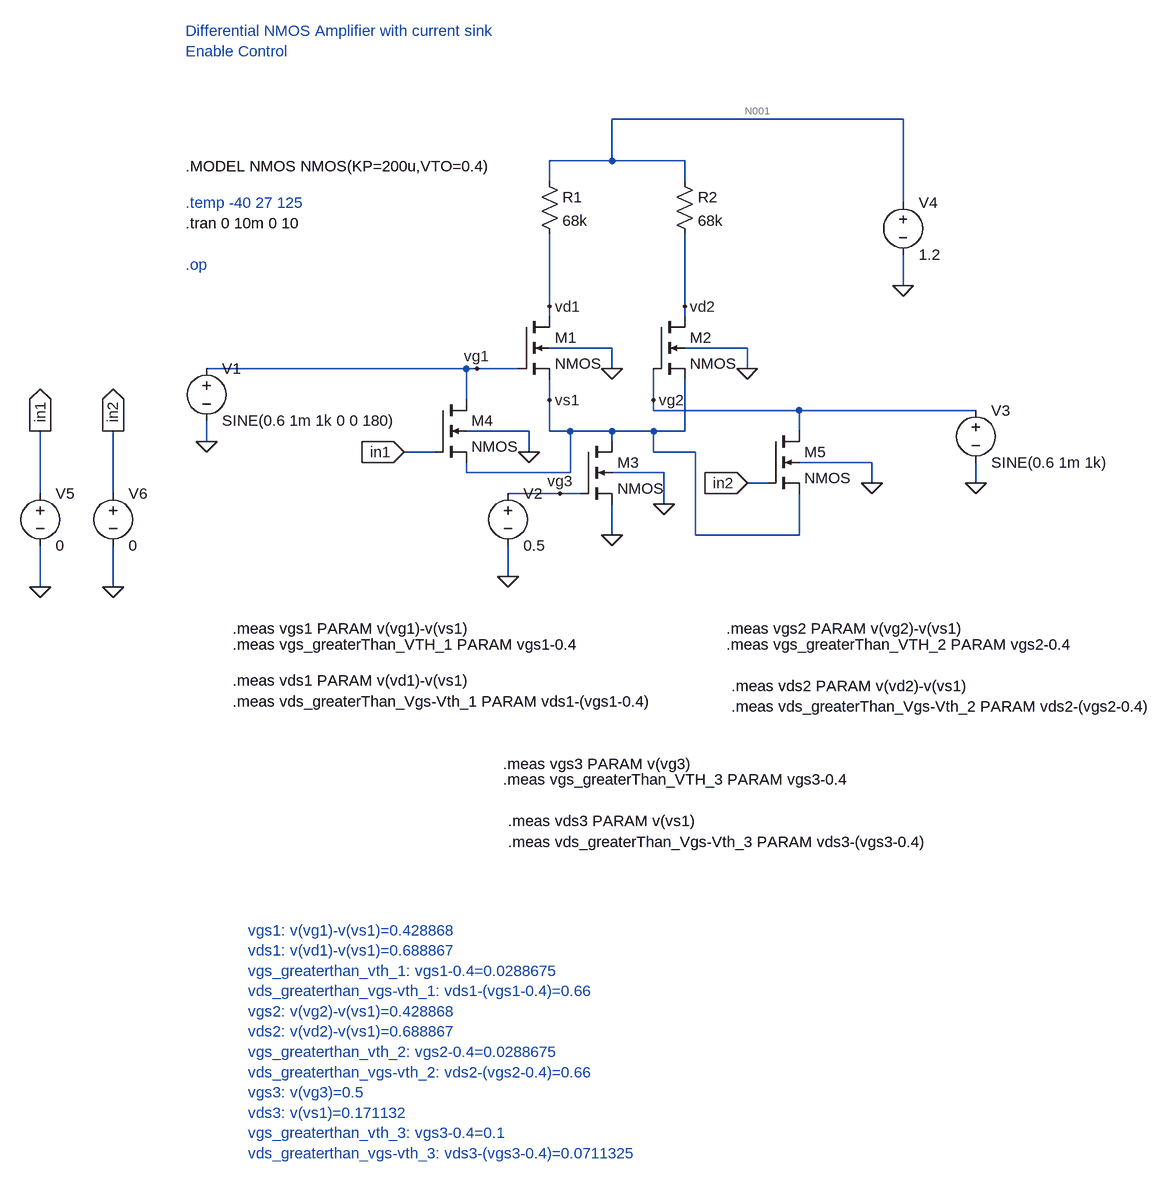
[diagram p0: schematic 3_differential_amplifier_gain_calculation.asc]
3_differential_amplifier_gain_calculation.asc, the LTspice schematic file:
Version 4
SHEET 1 1248 1140
WIRE 816 -432 368 -432
WIRE 368 -368 368 -432
WIRE 368 -368 272 -368
WIRE 480 -368 368 -368
WIRE 272 -336 272 -368
WIRE 480 -336 480 -368
WIRE 816 -304 816 -432
WIRE 816 -176 816 -224
WIRE 272 -144 272 -256
WIRE 480 -144 480 -256
WIRE 272 -128 272 -144
WIRE 480 -128 480 -144
WIRE 368 -80 272 -80
WIRE 576 -80 480 -80
WIRE 144 -48 -256 -48
WIRE 160 -48 144 -48
WIRE 224 -48 160 -48
WIRE 368 -48 368 -80
WIRE 576 -48 576 -80
WIRE 144 0 144 -48
WIRE 272 0 272 -32
WIRE 432 0 432 -48
WIRE 432 16 432 0
WIRE 656 16 432 16
WIRE 928 16 656 16
WIRE 240 48 144 48
WIRE 272 48 272 0
WIRE 304 48 272 48
WIRE 368 48 304 48
WIRE 432 48 368 48
WIRE 480 48 480 -32
WIRE 480 48 432 48
WIRE 656 48 656 16
WIRE -256 64 -256 32
WIRE 368 64 368 48
WIRE 96 80 48 80
WIRE 240 80 240 48
WIRE 432 80 432 48
WIRE 496 80 432 80
WIRE 768 96 656 96
WIRE 144 112 144 96
WIRE 304 112 304 48
WIRE 304 112 144 112
WIRE 448 112 368 112
WIRE 608 128 576 128
WIRE 768 128 768 96
WIRE 928 128 928 96
WIRE -512 144 -512 48
WIRE -400 144 -400 48
WIRE 288 144 208 144
WIRE 320 144 288 144
WIRE 448 160 448 112
WIRE 368 208 368 160
WIRE 496 208 496 80
WIRE 656 208 656 144
WIRE 656 208 496 208
WIRE 208 272 208 224
WIRE -512 288 -512 224
WIRE -400 288 -400 224
FLAG -256 64 0
FLAG 368 208 0
FLAG 368 -48 0
FLAG 576 -48 0
FLAG 928 128 0
FLAG 816 -176 0
FLAG 208 272 0
FLAG 448 160 0
FLAG 160 -48 vg1
FLAG 272 0 vs1
FLAG 272 -144 vd1
FLAG 432 0 vg2
FLAG 480 -144 vd2
FLAG 288 144 vg3
FLAG -512 288 0
FLAG -400 288 0
FLAG -512 48 in1
IOPIN -512 48 Out
FLAG -400 48 in2
IOPIN -400 48 Out
FLAG 768 128 0
FLAG 240 80 0
FLAG 48 80 in1
IOPIN 48 80 In
FLAG 576 128 in2
IOPIN 576 128 In
SYMBOL nmos4 224 -128 R0
SYMATTR InstName M1
SYMATTR Value2 l=1u w=60u
SYMBOL nmos4 432 -128 R0
SYMATTR InstName M2
SYMATTR Value2 l=1u w=60u
SYMBOL nmos4 320 64 R0
SYMATTR InstName M3
SYMATTR Value2 l=1u w=10u
SYMBOL voltage -256 -64 R0
WINDOW 123 0 0 Left 0
WINDOW 39 0 0 Left 0
SYMATTR InstName V1
SYMATTR Value SINE(0.6 1m 1k 0 0 180)
SYMBOL voltage 208 128 R0
WINDOW 123 0 0 Left 0
WINDOW 39 0 0 Left 0
SYMATTR InstName V2
SYMATTR Value 0.5
SYMBOL voltage 928 0 R0
WINDOW 123 0 0 Left 0
WINDOW 39 0 0 Left 0
SYMATTR InstName V3
SYMATTR Value SINE(0.6 1m 1k)
SYMBOL voltage 816 -320 R0
WINDOW 123 0 0 Left 0
WINDOW 39 0 0 Left 0
SYMATTR InstName V4
SYMATTR Value 1.2
SYMBOL res 256 -352 R0
SYMATTR InstName R1
SYMATTR Value 68k
SYMBOL res 464 -352 R0
SYMATTR InstName R2
SYMATTR Value 68k
SYMBOL voltage -512 128 R0
WINDOW 123 0 0 Left 0
WINDOW 39 0 0 Left 0
SYMATTR InstName V5
SYMATTR Value 0
SYMBOL voltage -400 128 R0
WINDOW 123 0 0 Left 0
WINDOW 39 0 0 Left 0
SYMATTR InstName V6
SYMATTR Value 0
SYMBOL nmos4 96 0 R0
SYMATTR InstName M4
SYMATTR Value2 l=1u w=60u
SYMBOL nmos4 608 48 R0
SYMATTR InstName M5
SYMATTR Value2 l=1u w=60u
TEXT -288 -568 Left 2 ;Differential NMOS Amplifier with current sink\nEnable Control
TEXT -288 -360 Left 2 !.MODEL NMOS NMOS(KP=200u,VTO=0.4)
TEXT -288 -272 Left 2 !.tran 0 10m 0 10
TEXT -216 352 Left 2 !.meas vgs1 PARAM v(vg1)-v(vs1)
TEXT -216 432 Left 2 !.meas vds1 PARAM v(vd1)-v(vs1)
TEXT -216 376 Left 2 !.meas vgs_greaterThan_VTH_1 PARAM vgs1-0.4
TEXT -216 464 Left 2 !.meas vds_greaterThan_Vgs-Vth_1 PARAM vds1-(vgs1-0.4)
TEXT 544 352 Left 2 !.meas vgs2 PARAM v(vg2)-v(vs1)
TEXT 552 440 Left 2 !.meas vds2 PARAM v(vd2)-v(vs1)
TEXT 544 376 Left 2 !.meas vgs_greaterThan_VTH_2 PARAM vgs2-0.4
TEXT 552 472 Left 2 !.meas vds_greaterThan_Vgs-Vth_2 PARAM vds2-(vgs2-0.4)
TEXT 200 560 Left 2 !.meas vgs3 PARAM v(vg3)
TEXT 208 648 Left 2 !.meas vds3 PARAM v(vs1)
TEXT 200 584 Left 2 !.meas vgs_greaterThan_VTH_3 PARAM vgs3-0.4
TEXT 208 680 Left 2 !.meas vds_greaterThan_Vgs-Vth_3 PARAM vds3-(vgs3-0.4)
TEXT -288 -208 Left 2 ;.op
TEXT -288 -304 Left 2 ;.temp -40 27 125
TEXT -192 816 Left 2 ;vgs1: v(vg1)-v(vs1)=0.428868\nvds1: v(vd1)-v(vs1)=0.688867\nvgs_greaterthan_vth_1: vgs1-0.4=0.0288675\nvds_greaterthan_vgs-vth_1: vds1-(vgs1-0.4)=0.66\nvgs2: v(vg2)-v(vs1)=0.428868\nvds2: v(vd2)-v(vs1)=0.688867\nvgs_greaterthan_vth_2: vgs2-0.4=0.0288675\nvds_greaterthan_vgs-vth_2: vds2-(vgs2-0.4)=0.66\nvgs3: v(vg3)=0.5\nvds3: v(vs1)=0.171132\nvgs_greaterthan_vth_3: vgs3-0.4=0.1\nvds_greaterthan_vgs-vth_3: vds3-(vgs3-0.4)=0.0711325

The netlist it stands for:
* 3_differential_amplifier_gain_calculation.asc
M1 vd1 vg1 vs1 0 NMOS l=1u w=60u
M2 vd2 vg2 vs1 0 NMOS l=1u w=60u
M3 vs1 vg3 0 0 NMOS l=1u w=10u
V1 vg1 0 SINE(0.6 1m 1k 0 0 180)
V2 vg3 0 0.5
V3 vg2 0 SINE(0.6 1m 1k)
V4 N001 0 1.2
R1 N001 vd1 68k
R2 N001 vd2 68k
V5 in1 0 0
V6 in2 0 0
M4 vg1 in1 vs1 0 NMOS l=1u w=60u
M5 vg2 in2 vs1 0 NMOS l=1u w=60u
.model NMOS NMOS
.model PMOS PMOS
.lib standard.mos
* Differential NMOS Amplifier with current sink
* Enable Control
.MODEL NMOS NMOS(KP=200u,VTO=0.4)
.tran 0 10m 0 10
.meas vgs1 PARAM v(vg1)-v(vs1)
.meas vds1 PARAM v(vd1)-v(vs1)
.meas vgs_greaterThan_VTH_1 PARAM vgs1-0.4
.meas vds_greaterThan_Vgs-Vth_1 PARAM vds1-(vgs1-0.4)
.meas vgs2 PARAM v(vg2)-v(vs1)
.meas vds2 PARAM v(vd2)-v(vs1)
.meas vgs_greaterThan_VTH_2 PARAM vgs2-0.4
.meas vds_greaterThan_Vgs-Vth_2 PARAM vds2-(vgs2-0.4)
.meas vgs3 PARAM v(vg3)
.meas vds3 PARAM v(vs1)
.meas vgs_greaterThan_VTH_3 PARAM vgs3-0.4
.meas vds_greaterThan_Vgs-Vth_3 PARAM vds3-(vgs3-0.4)
* .op
* .temp -40 27 125
* vgs1: v(vg1)-v(vs1)=0.428868
* vds1: v(vd1)-v(vs1)=0.688867
* vgs_greaterthan_vth_1: vgs1-0.4=0.0288675
* vds_greaterthan_vgs-vth_1: vds1-(vgs1-0.4)=0.66
* vgs2: v(vg2)-v(vs1)=0.428868
* vds2: v(vd2)-v(vs1)=0.688867
* vgs_greaterthan_vth_2: vgs2-0.4=0.0288675
* vds_greaterthan_vgs-vth_2: vds2-(vgs2-0.4)=0.66
* vgs3: v(vg3)=0.5
* vds3: v(vs1)=0.171132
* vgs_greaterthan_vth_3: vgs3-0.4=0.1
* vds_greaterthan_vgs-vth_3: vds3-(vgs3-0.4)=0.0711325
.backanno
.end

* Results of the author's LTspice run, read from the files saved beside the schematic
* Operating Point, zero values left out:
*   V(vd1) = 860 mV
*   V(vg1) = 600 mV
*   V(vs1) = 171.1 mV
*   V(vd2) = 860 mV
*   V(vg2) = 600 mV
*   V(vg3) = 500 mV
*   V(n001) = 1.2 V
*   Id(M5) = 1.039 pA
*   Id(M4) = 1.039 pA
*   Id(M3) = 10 µA
*   Is(M3) = -10 µA
*   Id(M2) = 5 µA
*   Ib(M2) = -1.051 pA
*   Is(M2) = -5 µA
*   Id(M1) = 5 µA
*   Ib(M1) = -1.051 pA
*   Is(M1) = -5 µA
*   I(R2) = 5 µA
*   I(R1) = 5 µA
*   I(V4) = -10 µA
*   I(V3) = -1.039 pA
*   I(V1) = -1.039 pA
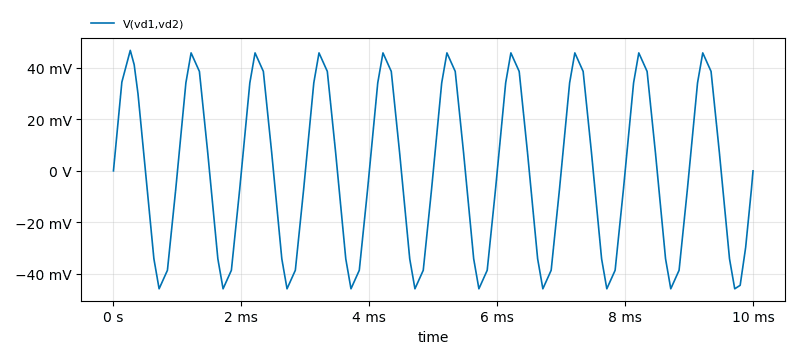
[diagram p1: Transient Analysis of 3_differential_amplifier_gain_calculation.asc, plotted from the saved traces]
* Transient Analysis, 1 run:
*   V(vd1,vd2): min -45.75 mV, max 46.73 mV, average -13.19 µV, rms 33.66 mV, last 59.6 nV
* From the log:
*   vgs1: v(vg1)-v(vs1)=0.428868
*   vds1: v(vd1)-v(vs1)=0.688867
*   vgs_greaterthan_vth_1: vgs1-0.4=0.0288675
*   vds_greaterthan_vgs-vth_1: vds1-(vgs1-0.4)=0.66
*   vgs2: v(vg2)-v(vs1)=0.428868
*   vds2: v(vd2)-v(vs1)=0.688867
*   vgs_greaterthan_vth_2: vgs2-0.4=0.0288675
*   vds_greaterthan_vgs-vth_2: vds2-(vgs2-0.4)=0.66
*   vgs3: v(vg3)=0.5
*   vds3: v(vs1)=0.171132
*   vgs_greaterthan_vth_3: vgs3-0.4=0.1
*   vds_greaterthan_vgs-vth_3: vds3-(vgs3-0.4)=0.0711325